# EAGLE schematic prototype3 (EAGLE 7.5.0)
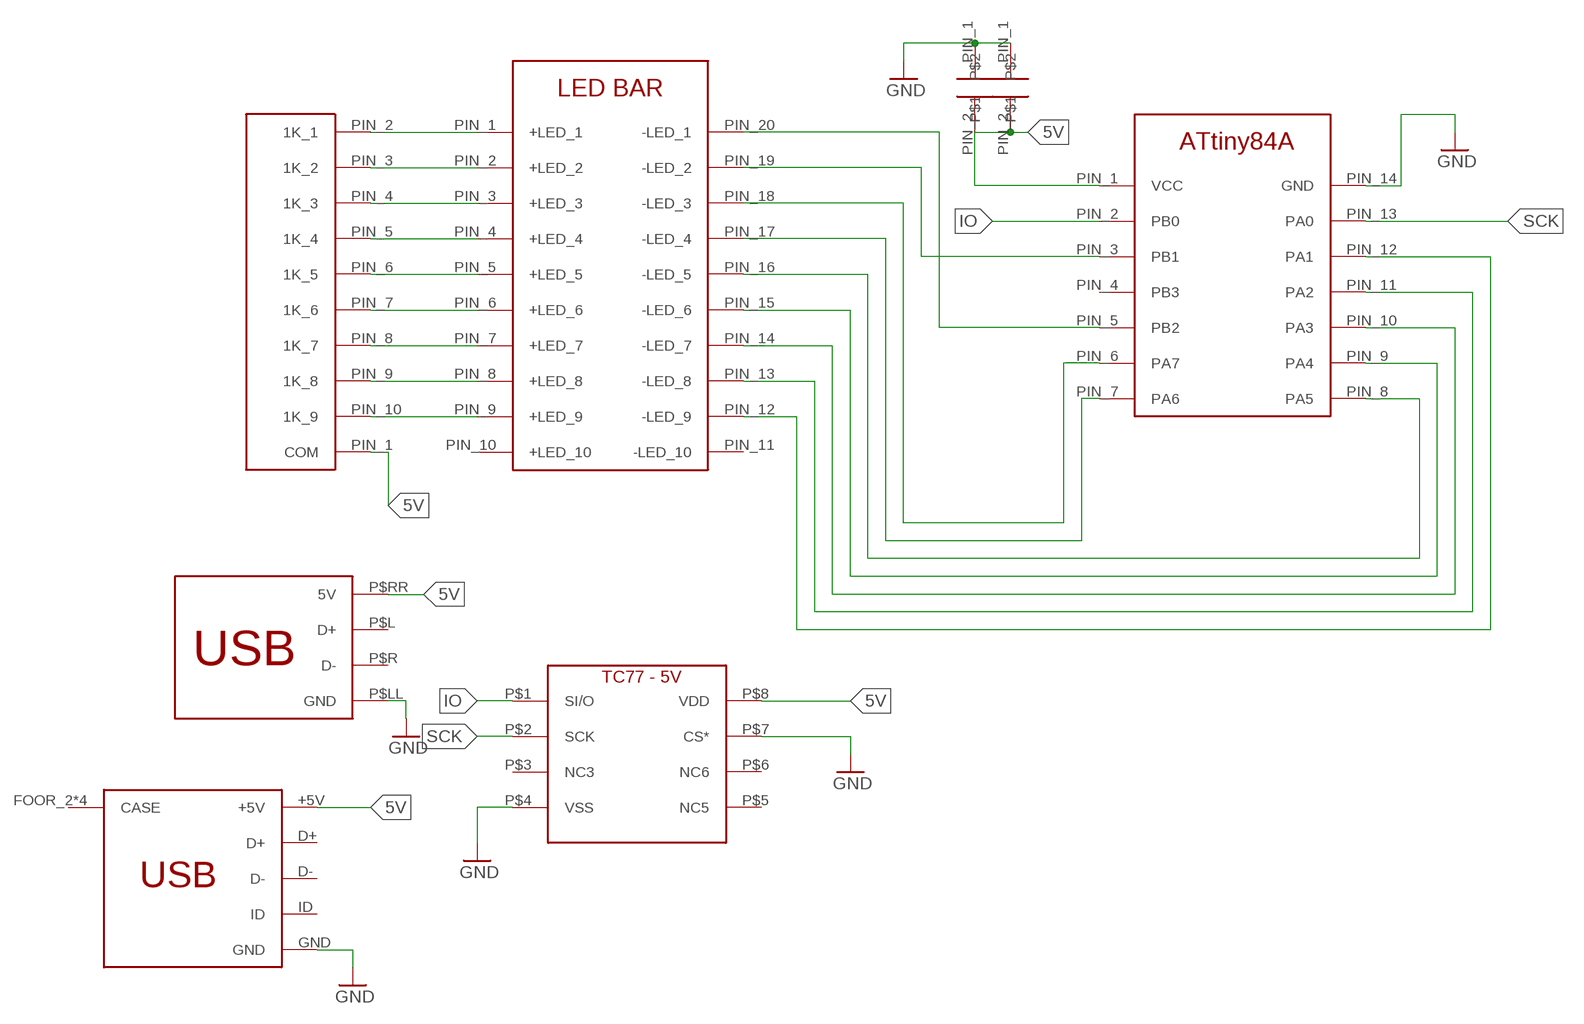
[diagram p0: schematic, sheet 1]

## Parts
U$1  9X_1K_BUSSED_R  [SIP-10]
U$2  10UF_FK18  [CAP_FK18]
U$3  ATTINY84A  [PDIP-14]
U$4  LED_X10_BAR  [LED_X10_BAR]
U$5  TC77  [SOIC-8]
U$6  10UF_FK18  [CAP_FK18]
U$7  USB_A_TH  [USB_A_TH]
U$8  USB_MINI  [SMT_MINI_USB]

## Nets
5V: U$1.PIN_1(COM) U$2.PIN_2 U$3.PIN_1(VCC) U$5.P$8(VDD) U$6.PIN_2 U$7.P$RR(5V) U$8.+5V
GND: U$2.PIN_1 U$3.PIN_14(GND) U$5.P$4(VSS) U$5.P$7(CS*) U$6.PIN_1 U$7.P$LL(GND) U$8.GND
IO: U$3.PIN_2(PB0) U$5.P$1(SI/O)
N$1: U$1.PIN_2(1K_1) U$4.PIN_1(+LED_1)
N$2: U$1.PIN_3(1K_2) U$4.PIN_2(+LED_2)
N$3: U$1.PIN_4(1K_3) U$4.PIN_3(+LED_3)
N$4: U$1.PIN_5(1K_4) U$4.PIN_4(+LED_4)
N$5: U$1.PIN_6(1K_5) U$4.PIN_5(+LED_5)
N$6: U$1.PIN_7(1K_6) U$4.PIN_6(+LED_6)
N$7: U$1.PIN_8(1K_7) U$4.PIN_7(+LED_7)
N$8: U$1.PIN_9(1K_8) U$4.PIN_8(+LED_8)
N$11: U$3.PIN_11(PA2) U$4.PIN_13(-LED_8)
N$12: U$3.PIN_12(PA1) U$4.PIN_12(-LED_9)
N$13: U$3.PIN_10(PA3) U$4.PIN_14(-LED_7)
N$14: U$3.PIN_9(PA4) U$4.PIN_15(-LED_6)
N$15: U$3.PIN_8(PA5) U$4.PIN_16(-LED_5)
N$16: U$3.PIN_7(PA6) U$4.PIN_17(-LED_4)
N$17: U$3.PIN_6(PA7) U$4.PIN_18(-LED_3)
N$18: U$3.PIN_3(PB1) U$4.PIN_19(-LED_2)
N$19: U$3.PIN_5(PB2) U$4.PIN_20(-LED_1)
N$20: U$1.PIN_10(1K_9) U$4.PIN_9(+LED_9)
SCK: U$3.PIN_13(PA0) U$5.P$2(SCK)
Unconnected: U$3.PIN_4(PB3) U$4.PIN_10(+LED_10) U$4.PIN_11(-LED_10) U$5.P$3(NC3) U$5.P$5(NC5) U$5.P$6(NC6) U$7.P$L(D+) U$7.P$R(D-) U$8.D+ U$8.D- U$8.FOOR_2(CASE) U$8.FOOT_1(CASE) U$8.FOOT_3(CASE) U$8.FOOT_4(CASE) U$8.ID

## Library data of the parts
U$1 = Next_Make_CPW_2015:9X_1K_BUSSED_R
U$2 U$6 = Next_Make_CPW_2015:10UF_FK18
U$3 = Next_Make_CPW_2015:ATTINY84A
U$4 = Next_Make_CPW_2015:LED_X10_BAR
U$5 = Next_Make_CPW_2016:TC77
U$7 = Next_Make_CPW_2016:USB_A_TH
U$8 = Next_Make_CPW_2016:USB_MINI